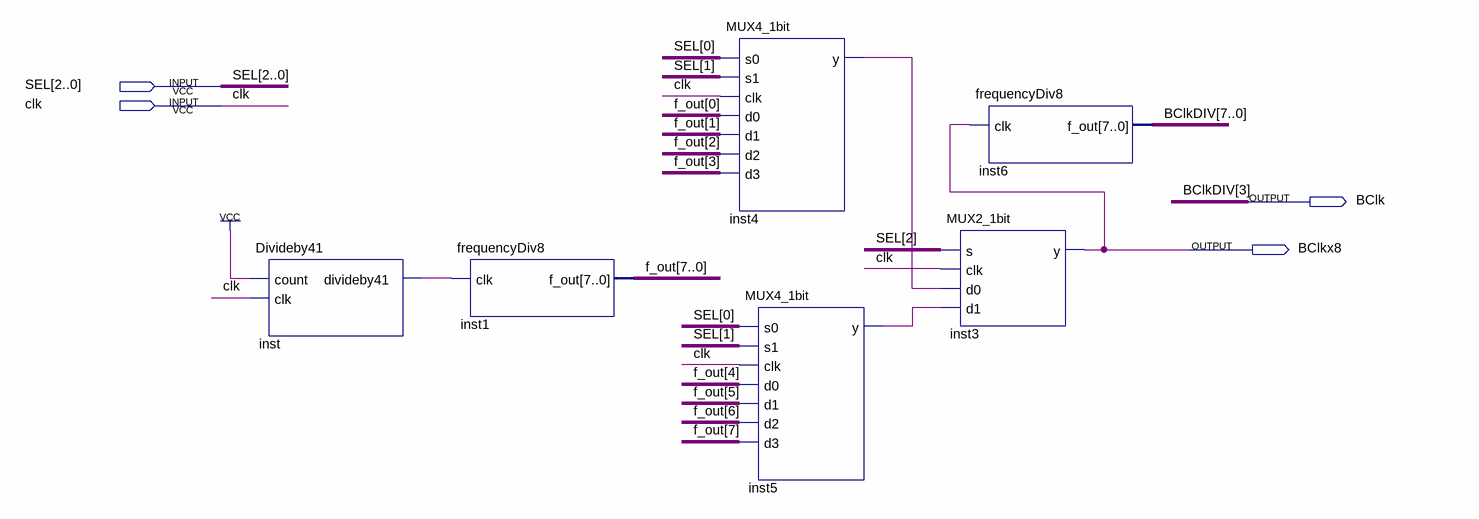
[diagram p0: schematic sheet]
// Quartus schematic baudRateGen.bdf as structural Verilog: 6 symbols, 4 pins
module baudRateGen (
  input  [2:0] SEL,
  input  clk,
  output BClk,
  output BClkx8
);

  wire inst4_y, inst5_y, inst_divideby41;
  wire [7:0] BClkDIV, f_out;

  Divideby41 inst (.count(1'b1), .clk(clk), .divideby41(inst_divideby41));
  frequencyDiv8 inst1 (.clk(inst_divideby41), .f_out(f_out));
  MUX4_1bit inst4 (
    .s0(SEL[0]), .s1(SEL[1]), .clk(clk), .d0(f_out[0]), .d1(f_out[1]), .d2(f_out[2]), .d3(f_out[3]),
    .y(inst4_y));
  MUX4_1bit inst5 (
    .s0(SEL[0]), .s1(SEL[1]), .clk(clk), .d0(f_out[4]), .d1(f_out[5]), .d2(f_out[6]), .d3(f_out[7]),
    .y(inst5_y));
  frequencyDiv8 inst6 (.clk(BClkx8), .f_out({BClkDIV[7:4], BClk, BClkDIV[2:0]}));
  MUX2_1bit inst3 (.s(SEL[2]), .clk(clk), .d0(inst4_y), .d1(inst5_y), .y(BClkx8));

  // Other names for the same wires on the sheet: BClkDIV[3] = BClk
endmodule
